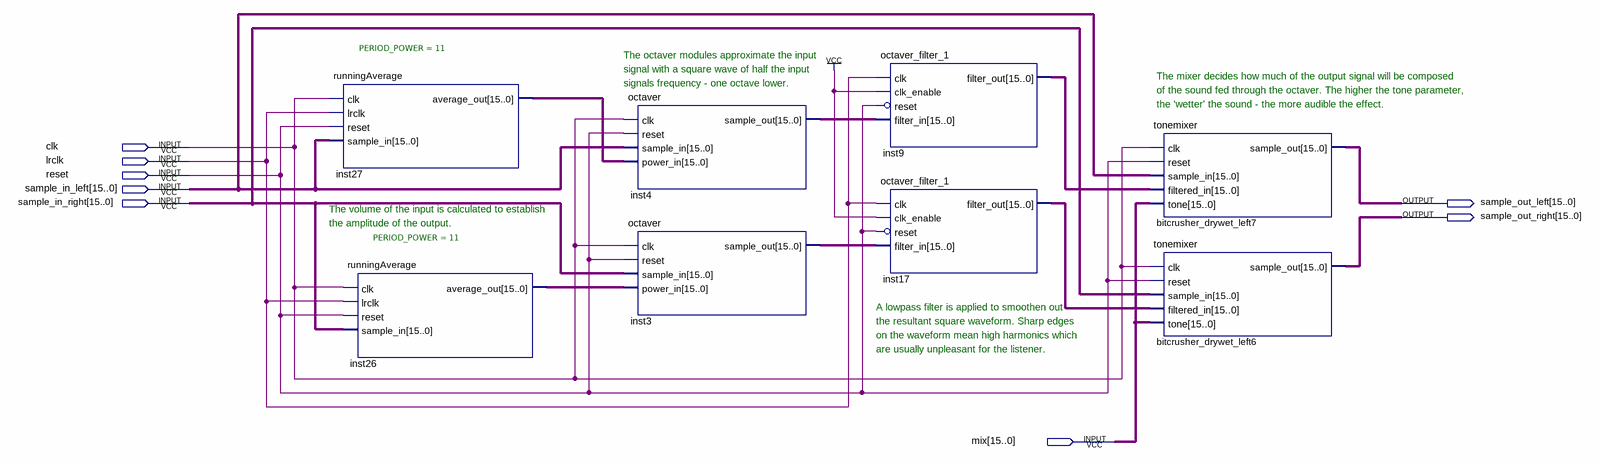
[diagram p0: schematic sheet]
// Quartus schematic octaver_effect.bdf as structural Verilog: 8 symbols, 8 pins
module octaver_effect (
  input  clk,
  input  lrclk,
  input  reset,
  input  [15:0] sample_in_left,
  input  [15:0] sample_in_right,
  input  [15:0] mix,
  output [15:0] sample_out_left,
  output [15:0] sample_out_right
);

  wire [15:0] inst3_sample_out, inst4_sample_out, inst9_filter_out, inst17_filter_out, inst26_average_out,
       inst27_average_out;

  runningAverage #(.PERIOD_POWER(11)) inst27 (
    .clk(clk), .lrclk(lrclk), .reset(reset), .sample_in(sample_in_left), .average_out(inst27_average_out));
  runningAverage #(.PERIOD_POWER(11)) inst26 (
    .clk(clk), .lrclk(lrclk), .reset(reset), .sample_in(sample_in_right), .average_out(inst26_average_out));
  octaver inst4 (
    .clk(clk), .reset(reset), .sample_in(sample_in_left), .power_in(inst27_average_out),
    .sample_out(inst4_sample_out));
  octaver inst3 (
    .clk(clk), .reset(reset), .sample_in(sample_in_right), .power_in(inst26_average_out),
    .sample_out(inst3_sample_out));
  octaver_filter_1 inst9 (
    .clk(lrclk), .clk_enable(1'b1), .reset(~reset), .filter_in(inst4_sample_out),
    .filter_out(inst9_filter_out));
  octaver_filter_1 inst17 (
    .clk(lrclk), .clk_enable(1'b1), .reset(~reset), .filter_in(inst3_sample_out),
    .filter_out(inst17_filter_out));
  tonemixer bitcrusher_drywet_left7 (
    .clk(clk), .reset(reset), .sample_in(sample_in_left), .filtered_in(inst9_filter_out), .tone(mix),
    .sample_out(sample_out_left));
  tonemixer bitcrusher_drywet_left6 (
    .clk(clk), .reset(reset), .sample_in(sample_in_right), .filtered_in(inst17_filter_out), .tone(mix),
    .sample_out(sample_out_right));

  // Notes on the sheet:
  //   The octaver modules approximate the input
  //   signal with a square wave of half the input
  //   The mixer decides how much of the output signal will be composed
  //   signals frequency - one octave lower.
  //   of the sound fed through the octaver. The higher the tone parameter,
  //   the 'wetter' the sound - the more audible the effect.
  //   The volume of the input is calculated to establish
  //   the amplitude of the output.
  //   A lowpass filter is applied to smoothen out
  //   the resultant square waveform. Sharp edges
  //   on the waveform mean high harmonics which
  //   are usually unpleasant for the listener.
endmodule
